# EasyEDA Pro project STM32F103-260914.epro, schematic Schematic1
Board Name: Board1; Create Date: 2026-09-14; Page Name: P1; Project Name: STMF103-260914; Schematic Name: Schematic1; Update Date: 2026-09-17; Company: 嘉立创EDA; Page Size: A4; Version: V1.0
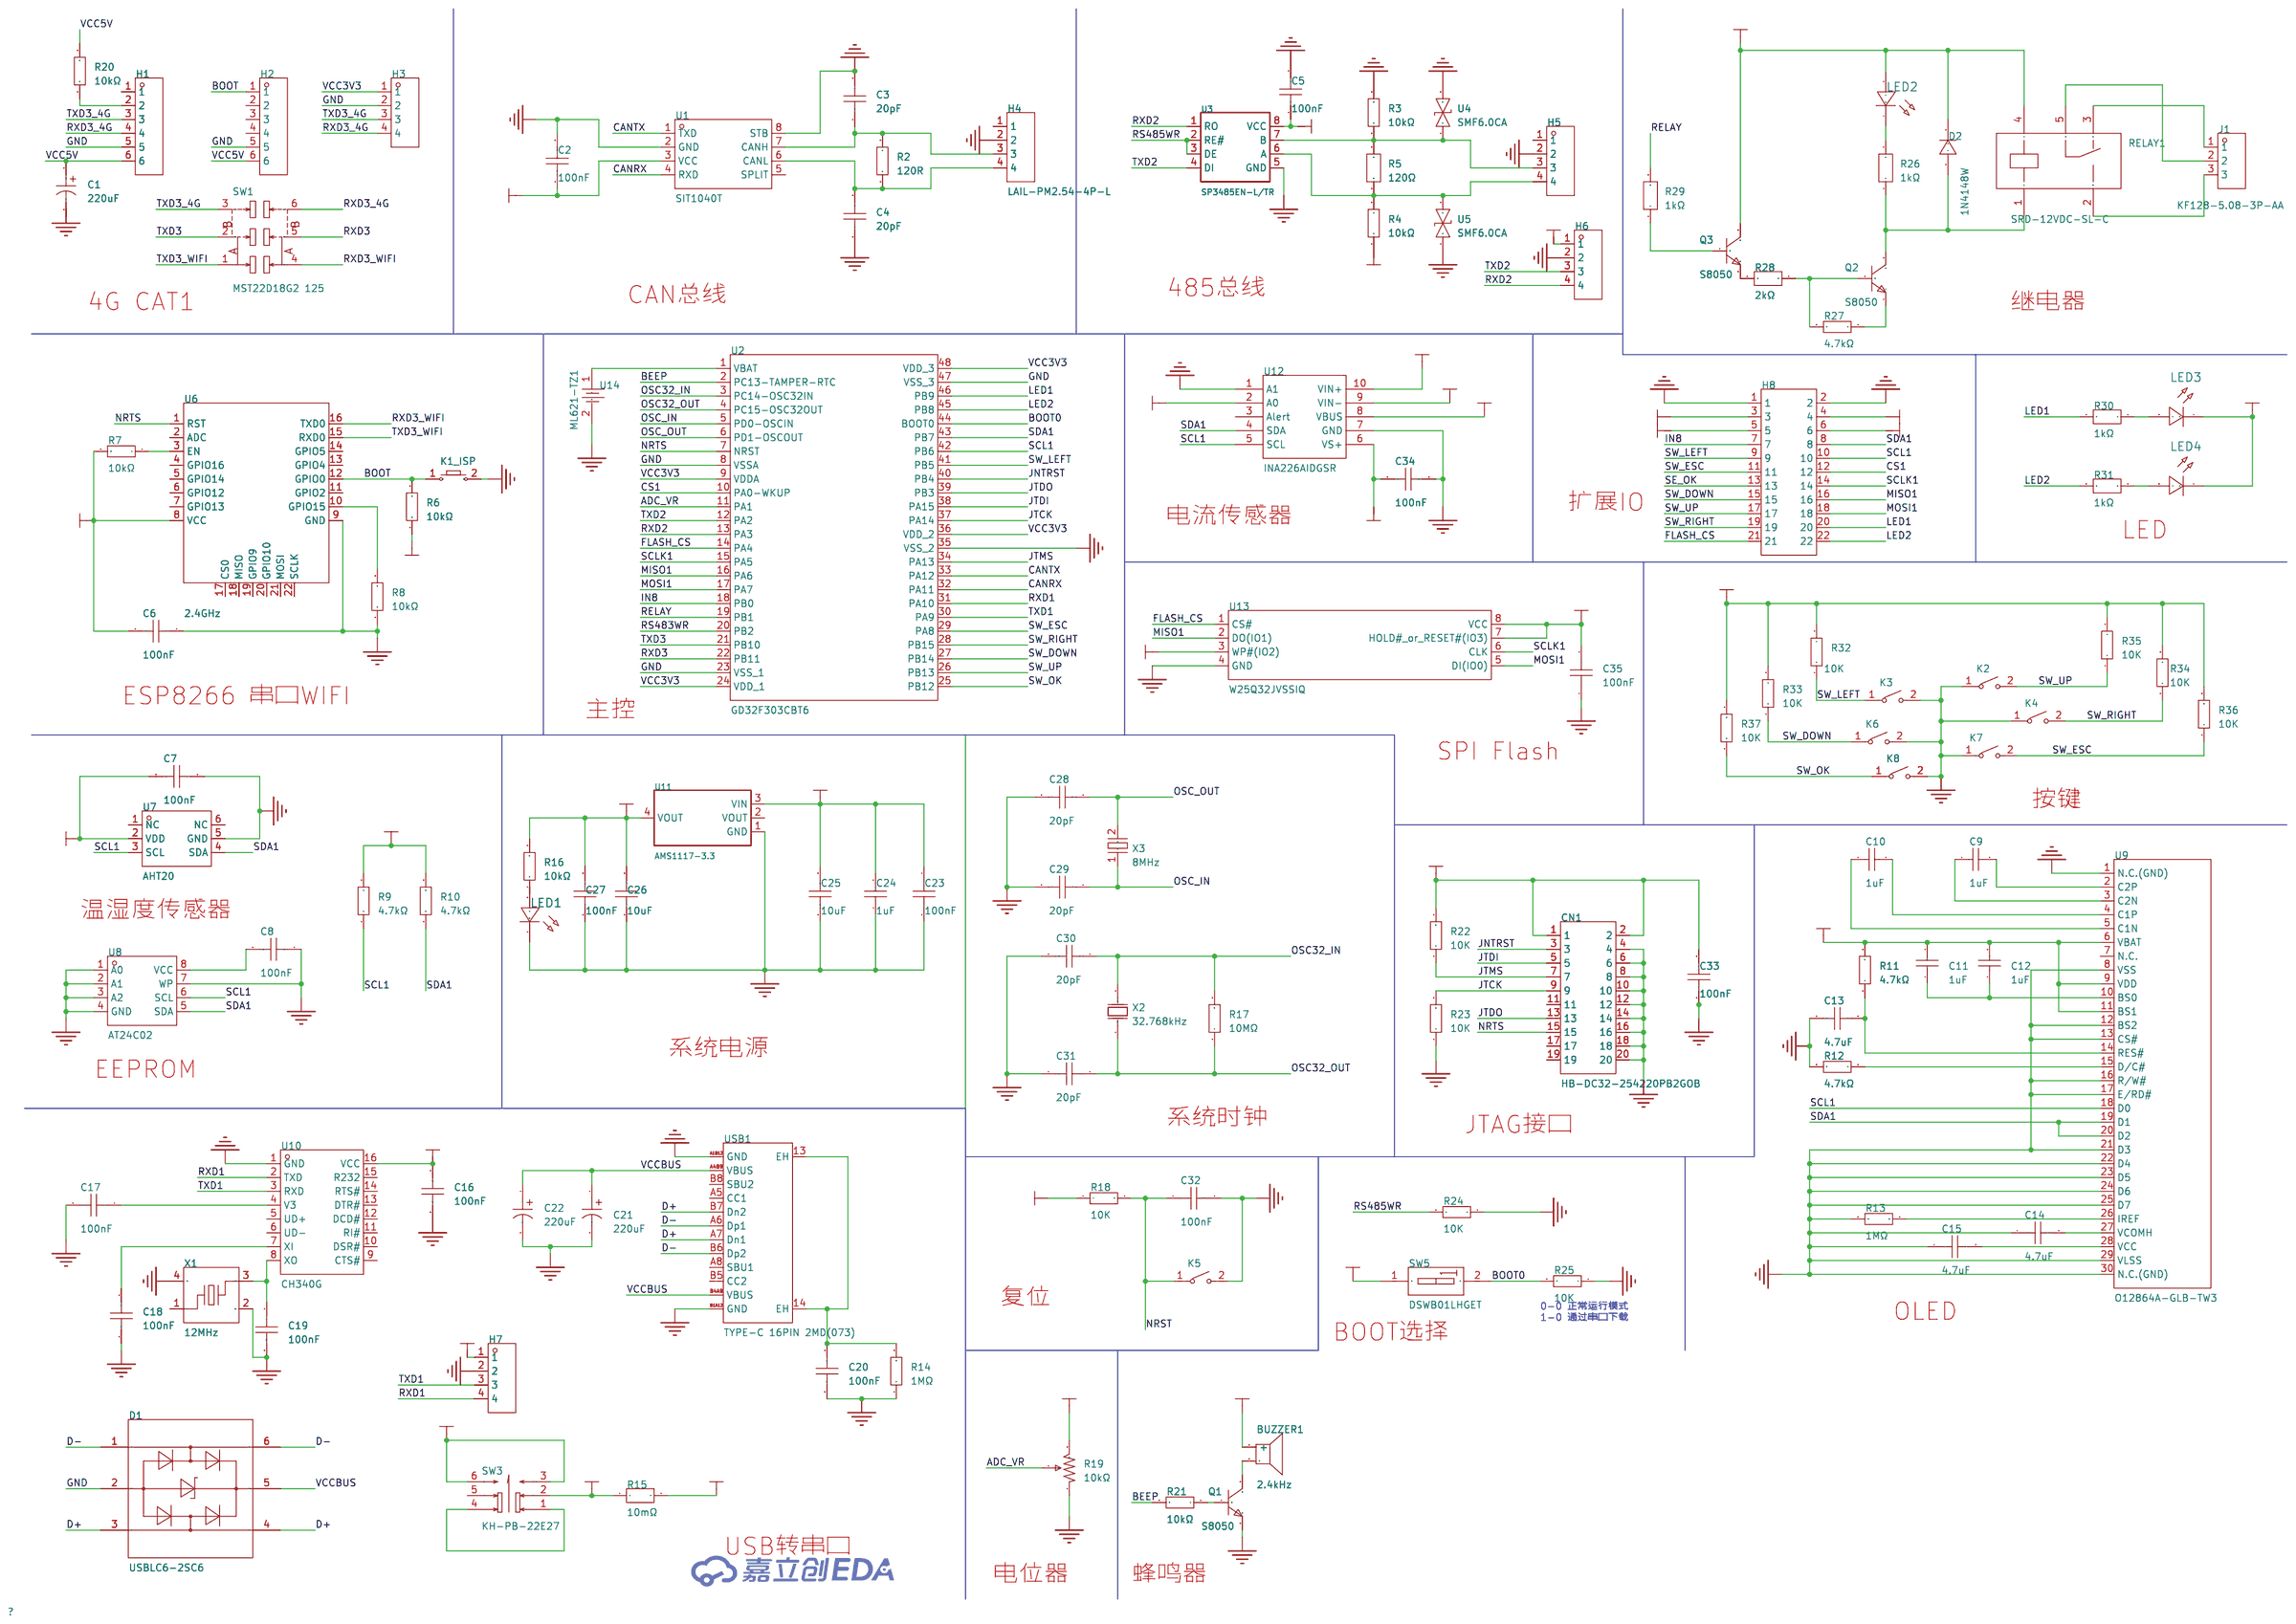
[diagram p0: schematic sheet]

## Parts
BUZZER1  2.4kHz  [BUZ-TH_BD12.0-P7.60-D0.6-FD]
C1  220uF  [CAP-SMD_BD6.3-L6.6-W6.6-FD]
C2  100nF  [C0805]
C3  20pF  [C0805]
C4  20pF  [C0805]
C5  100nF  [C0603]
C6  100nF  [C0603]
C7  100nF  [C0603]
C8  100nF  [C0603]
C9  1uF  [C0603]
C10  1uF  [C0603]
C11  1uF  [C0603]
C12  1uF  [C0603]
C13  4.7uF  [C0603]
C14  4.7uF  [C0603]
C15  4.7uF  [C0603]
C16  100nF  [C0603]
C17  100nF  [C0603]
C18  100nF  [C0603]
C19  100nF  [C0603]
C20  100nF  [C0603]
C21  220uF  [CAP-SMD_BD6.3-L6.6-W6.6-FD]
C22  220uF  [CAP-SMD_BD6.3-L6.6-W6.6-FD]
C23  100nF  [C0603]
C24  1uF  [C0603]
C25  10uF  [C0603]
C26  10uF  [C0603]
C27  100nF  [C0603]
C28  20pF  [C0805]
C29  20pF  [C0805]
C30  20pF  [C0805]
C31  20pF  [C0805]
C32  100nF  [C0603]
C33  100nF  [C0603]
C34  100nF  [C0603]
C35  100nF  [C0603]
CN1  HB-DC32-254220PB2GOB  [CONN-TH-20P_HB-DC32-254220PB2GOB]
D1  USBLC6-2SC6  [SOT-23-6_L2.9-W1.6-P0.95-LS2.8-BL]
D2  1N4148W  [SOD-123F_L2.7-W1.6-LS3.8-RD]
H1  -  [HDR-TH_6P-P2.54-V-F]
H2  -  [HDR-TH_6P-P2.54-V-F]
H3  -  [HDR-TH_4P-P2.54-V-F]
H4  LAIL-PM2.54-4P-L  [HDR-TH_4P-P2.54-V-F]
H5  PM254V-11-04-H85  [HDR-TH_4P-P2.54-V-F]
H6  -  [HDR-TH_4P-P2.54-V-F]
H7  -  [HDR-TH_4P-P2.54-V-F]
H8  PZ254V-12-22P  [HDR-TH_22P-P2.54-V-M-R2-C11-S2.54]
J1  KF128-5.08-3P-AA  [CONN-TH_3P-P5.08_KF128-5.08-3P]
K1_ISP  KH-6X6X5H-STM  [SW-SMD_4P-L6.0-W6.0-P4.50-LS9.0_H5.0]
K2  TS-1088R-02026  [SW-SMD_L3.9-W3.0-P4.45]
K3  TS-1088R-02026  [SW-SMD_L3.9-W3.0-P4.45]
K4  TS-1088R-02026  [SW-SMD_L3.9-W3.0-P4.45]
K5  TS-1088R-02026  [SW-SMD_L3.9-W3.0-P4.45]
K6  TS-1088R-02026  [SW-SMD_L3.9-W3.0-P4.45]
K7  TS-1088R-02026  [SW-SMD_L3.9-W3.0-P4.45]
K8  TS-1088R-02026  [SW-SMD_L3.9-W3.0-P4.45]
LED1  -  [LED_0603]
LED2  -  [LED_0603]
LED3  -  [LED_0603]
LED4  -  [LED_0603]
Q1  S8050  [SOT-23-3_L2.9-W1.3-P1.90-LS2.3-BR]
Q2  S8050  [SOT-23-3_L2.9-W1.3-P1.90-LS2.3-BR]
Q3  S8050  [SOT-23-3_L2.9-W1.3-P1.90-LS2.3-BR]
R2  120R  [R0805]
R3  10kΩ  [R0603]
R4  10kΩ  [R0603]
R5  120Ω  [R1206]
R6  10kΩ  [R0603]
R7  10kΩ  [R0603]
R8  10kΩ  [R0603]
R9  4.7kΩ  [R0402]
R10  4.7kΩ  [R0402]
R11  4.7kΩ  [R0402]
R12  4.7kΩ  [R0402]
R13  1MΩ  [R0603]
R14  1MΩ  [R0603]
R15  10mΩ  [R2512]
R16  10kΩ  [R0603]
R17  10MΩ  [R0603]
R18  10K  [R0805]
R19  10kΩ  [RES-ADJ-TH_3362P]
R20  10kΩ  [R0603]
R21  10kΩ  [R0603]
R22  10K  [R0805]
R23  10K  [R0805]
R24  10K  [R0805]
R25  10K  [R0805]
R26  1kΩ  [R0603]
R27  4.7kΩ  [R0402]
R28  2kΩ  [R0603]
R29  1kΩ  [R0603]
R30  1kΩ  [R0603]
R31  1kΩ  [R0603]
R32  10K  [R0805]
R33  10K  [R0805]
R34  10K  [R0805]
R35  10K  [R0805]
R36  10K  [R0805]
R37  10K  [R0805]
RELAY1  SRD-12VDC-SL-C  [RELAY-TH_SRD-XXVDC-XL-C]
SW1  MST22D18G2 125  [SW-SMD_MST22D18G2]
SW3  KH-PB-22E27  [SW-TH_6P-L7.0-W7.0-P2.00-LS5.0]
SW5  DSWB01LHGET  [SW-TH_DSWB01LHGET]
U1  SIT1040T  [SO-8_L4.9-W3.9-P1.27-LS5.9-BL]
U2  GD32F303CBT6  [LQFP-48_L7.0-W7.0-P0.50-LS9.0-BL]
U3  SP3485EN-L/TR  [SO-8_L4.9-W3.9-P1.27-LS6.0-BL]
U4  SMF6.0CA  [SOD-123FL_L2.8-W1.8-LS3.7-BI]
U5  SMF6.0CA  [SOD-123FL_L2.8-W1.8-LS3.7-BI]
U6  2.4GHz  [WIFIM-SMD_ESP-12F-ESP8266MOD]
U7  AHT20  [SENSOR-SMD_L3.0-W3.0-P1.00-BR]
U8  AT24C02  [SOP-8_L5.0-W4.0-P1.27-LS6.0-BL]
U9  O12864A-GLB-TW3  [LCD-SMD_O12864A-GLB-TW3]
U10  CH340G  [SOIC-16_L9.9-W3.9-P1.27-LS6.0-BL]
U11  AMS1117-3.3  [SOT-223-3_L6.5-W3.4-P2.30-LS7.0-BR]
U12  INA226AIDGSR  [MSOP-10_L3.0-W3.0-P0.50-LS5.0-BL]
U13  W25Q32JVSSIQ  [SOIC-8_L5.3-W5.3-P1.27-LS8.0-BL]
U14  ML621-TZ1  [BAT-SMD_ML621-TZ1]
USB1  TYPE-C 16PIN 2MD(073)  [USB-C-SMD_TYPE-C-16PIN-2MD-073]
X1  12MHz  [CRYSTAL-SMD_4P-L3.2-W2.5-BL]
X2  32.768kHz  [OSC-SMD_L3.2-W1.5]
X3  8MHz  [CRYSTAL-SMD_L5.0-W3.2]

## Library data of the parts
BUZZER1 = TMB12A05_C96093: 驱动方式:有源(内含驱动线路);构造类型:电磁式;额定电压:5V;频率:2.4kHz;声压(SPL):85dB;; LCSC Part Name: 有源(内含驱动线路) 电磁式 2.4kHz; Supplier Part: C96093; Manufacturer: 华能; Manufacturer Part: TMB12A05; Supplier Footprint: 插件,D=12mm; JLCPCB Part Class: 扩展库; Datasheet: https://item.szlcsc.com/datasheet/TMB12A05/97297.html; Supplier: LCSC; Driver Circuitry: 有源(内含驱动线路); Technology: 电磁式; Voltage Rating: 5V; Voltage - Supply: 4V~8V; Current Consumption: 30mA; Sound Pressure Level(SPL): 85dB; Diameter(φD): 12mm; Height: 9.8mm; Operating Temperature: -40℃~+85℃; Mounting Type: 插件
C1 = JVJ35V220M6x8: 容值:220uF;精度:±20%;额定电压:35V;纹波电流:190mA@120Hz;; LCSC Part Name: 220uF ±20% 35V; Supplier Part: C46550411; Manufacturer: JIERR(捷而瑞); Supplier Footprint: SMD,D6.3xL7.7mm; JLCPCB Part Class: 扩展库; Datasheet: https://item.szlcsc.com/datasheet/JVJ35V220M6x8/48680105.html; Supplier: LCSC; Tolerance: ±20%; Voltage Rating: 35V; Ripple Current: 190mA@120Hz; Diameter: 6.3mm; Height - Seated (Max): 7.7mm; Lifetime: 2000hrs@105℃; Operating Temperature: -55℃~+105℃
C2-C4 C28-C31 = CAP_0805: Supplier Footprint: 0805
C5-C8 C16-C20 C23 C27 C32-C35 = CC0603KRX7R0BB104: 容值:100nF;精度:±10%;额定电压:100V;温度系数:X7R;; LCSC Part Name: 100nF ±10% 100V; Supplier Part: C113803; Manufacturer: YAGEO(国巨); Supplier Footprint: 0603; Datasheet: https://item.szlcsc.com/datasheet/CC0603KRX7R0BB104/115039.html; Supplier: LCSC; Tolerance: ±10%; Voltage Rating: 100V; Temperature Coefficient: X7R
C9-C12 C24 = CC0603KRX5R8BB105: 容值:1uF;精度:±10%;额定电压:25V;温度系数:X5R;; LCSC Part Name: 1uF ±10% 25V; Supplier Part: C14664; Manufacturer: YAGEO(国巨); Supplier Footprint: 0603; JLCPCB Part Class: 扩展库; Datasheet: https://item.szlcsc.com/datasheet/CC0603KRX5R8BB105/15332.html; Supplier: LCSC; Tolerance: ±10%; Voltage Rating: 25V; Temperature Coefficient: X5R
C13-C15 = CL10A475KO8NNNC: 容值:4.7uF;精度:±10%;额定电压:16V;温度系数:X5R;; LCSC Part Name: 4.7uF ±10% 16V; Supplier Part: C19666; Manufacturer: SAMSUNG(三星); Supplier Footprint: 0603; JLCPCB Part Class: 基础库; Datasheet: https://item.szlcsc.com/datasheet/CL10A475KO8NNNC/20375.html; Supplier: LCSC; Tolerance: ±10%; Voltage Rating: 16V; Temperature Coefficient: X5R
C21 C22 = 189RV0019: 容值:220uF;精度:±20%;额定电压:35V;纹波电流:600mA@100kHz;等效串联电阻(ESR):160mΩ@100kHz;; LCSC Part Name: 220uF ±20% 35V; Supplier Part: C7471881; Manufacturer: KNSCHA(科尼盛); Supplier Footprint: SMD,D6.3xL7.7mm; JLCPCB Part Class: 扩展库; Datasheet: https://item.szlcsc.com/datasheet/189RV0019/8528081.html; Supplier: LCSC; Tolerance: ±20%; Voltage Rating: 35V; Ripple Current: 600mA@100kHz; Equivalent Series Resistance(ESR): 160mΩ@100kHz; Diameter: 6.3mm; Height - Seated (Max): 7.7mm; Lifetime: 2000hrs@105℃; Operating Temperature: -55℃~+105℃
C25 C26 = CL10A106MA8NRNC: 容值:10uF;精度:±20%;额定电压:25V;温度系数:X5R;; LCSC Part Name: 10uF ±20% 25V; Supplier Part: C96446; Manufacturer: SAMSUNG(三星); Supplier Footprint: 0603; Datasheet: https://item.szlcsc.com/datasheet/CL10A106MA8NRNC/97651.html; Supplier: LCSC; Tolerance: ±20%; Voltage Rating: 25V; Temperature Coefficient: X5R
CN1 = HB-DC32-254220PB2GOB: 连接器类型:简牛座;间距:2.54mm;结构:2x10P;额定电流:3A;安装方式:直插;行距:2.54mm;排数:2;每排PIN数:10;触头材质:黄铜;触头镀层:金;工作温度:-40℃~+105℃;; LCSC Part Name: 2.54mm 2x10P 排数:2 每排P数:10; Supplier Part: C46598206; Manufacturer: HANBO(汉博); Supplier Footprint: 插件,P=2.54mm; Datasheet: https://item.szlcsc.com/datasheet/HB-DC32-254220PB2GOB/48740869.html; Supplier: LCSC; Connector Type: 简牛座; Pitch: 2.54mm; Number of Positions or Pins: 2x10P; Current Rating: 3A; Holder Type: 直插; Row Spacing: 2.54mm; Number of Rows: 2; Number of PINs Per Row: 10; Contact Material: 黄铜; Contact Plating: 金; Operating Temperature: -40℃~+105℃; Color: 黑色
D1 = USBLC6-2SC6_C7519: 极性:单向;反向截止电压(Vrwm):5.25V;钳位电压:17V;峰值脉冲电流(Ipp):5A;击穿电压(VBR):6V;; LCSC Part Name: 单向ESD 5.25V截止 峰值脉冲电流：5A; Supplier Part: C7519; Manufacturer: ST(意法半导体); Supplier Footprint: SOT-23-6L; JLCPCB Part Class: 扩展库; Datasheet: https://item.szlcsc.com/datasheet/USBLC6-2SC6/7996.html; Supplier: LCSC; Polarity: 单向; Reverse Stand-Off Voltage (Vrwm): 5.25V; Clamping Voltage: 17V; Peak Pulse Current (Ipp): 5A; Voltage - Breakdown: 6V; Reverse Leakage Current (Ir): 150nA; Number of Channels: 双路; Operating Temperature: -40℃~+125℃; level of protection: IEC 61000-4-2; Type: ESD; Junction Capacitance: 3.5pF
D2 = 1N4148W_C81598: 二极管配置:独立式;正向压降(Vf):1V@50mA;直流反向耐压(Vr):75V;整流电流:150mA;反向恢复时间(Trr):4ns;; Supplier Part: C81598; Manufacturer: ST(先科); Supplier Footprint: SOD-123; Datasheet: https://item.szlcsc.com/datasheet/1N4148W/82750.html; Supplier: LCSC; Diode Configuration: 独立式; Voltage - Forward(Vf@If): 1V@50mA; Voltage - DC Reverse(Vr): 75V; Current - Rectified: 150mA; Pd - Power Dissipation: 400mW; Reverse Leakage Current (Ir): 1uA@75V; Reverse Recovery Time (trr): 4ns; Non-Repetitive Peak Forward Surge Current: 1A
H1 H2 = HDR-F_2.54_1x6P: Supplier Part: C40877; Supplier Footprint: 插件
H3 H6 H7 = HDR-F_2.54_1x4P: Supplier Part: C2718488; Supplier Footprint: 插件
H4 = LAIL-PM2.54-4P-L: 插孔结构:1x4P;间距:2.54mm;圆孔/方孔:方孔;安装方式:直插;排数:单排;总孔位数:4P;额定电流:3A;额定电压:250V;插孔方向:顶部;塑高:8.5mm;触头材质:黄铜;触头镀层:金;工作温度:-25℃~+80℃;; LCSC Part Name: 1x4P 间距:2.54mm 直插; Supplier Part: C54973823; Manufacturer: LAILAN(莱联); Supplier Footprint: 插件,P=2.54mm; JLCPCB Part Class: Extended Part; Datasheet: https://item.szlcsc.com/datasheet/LAIL-PM2.54-4P-L/58554901.html; Supplier: LCSC; Holes Structure: 1x4P; Pitch: 2.54mm; Circular Hole / Square Hole: 方孔; Mounting Type: 直插; Number of Rows: 单排; Number of Positions: 4P; Current Rating: 3A; Voltage Rating (Max): 250V; Holes Direction: 顶部; Insulation Height: 8.5mm; Contact Material: 黄铜; Contact Plating: 金; Operating Temperature: -25℃~+80℃; PIN Length: 3mm
H5 = PM254V-11-04-H85: 插孔结构:1x4P;间距:2.54mm;行距:-;圆孔/方孔:方孔;安装方式:直插;排数:单排;总孔位数:4P;额定电流:3A;额定电压:250V;插孔方向:顶部;塑高:8.5mm;触头材质:黄铜;触头镀层:金;工作温度:-40℃~+105℃;; LCSC Part Name: 1x4P 间距:2.54mm 直插; Supplier Part: C541851; Manufacturer: XFCN(兴飞); Supplier Footprint: 插件,P=2.54mm; JLCPCB Part Class: Extended Part; Datasheet: https://item.szlcsc.com/datasheet/PM254V-11-04-H85/562472.html; Supplier: LCSC; Holes Structure: 1x4P; Pitch: 2.54mm; Circular Hole / Square Hole: 方孔; Mounting Type: 直插; Number of Rows: 单排; Number of Positions: 4P; Current Rating: 3A; Voltage Rating (Max): 250V; Holes Direction: 顶部; Insulation Height: 8.5mm; Contact Material: 黄铜; Contact Plating: 金; Operating Temperature: -40℃~+105℃; PIN Length: 3.2mm
H8 = PZ254V-12-22P: 插针结构:2x11P;间距:2.54mm;行距:2.54mm;圆针/方针:方针;安装方式:直插;排数:双排;总PIN位数:22P;额定电流:-;额定电压:-;配合针长度:6mm;塑高:2.5mm;端接针长度:3mm;触头材质:黄铜;触头镀层:-;工作温度:-40℃~+105℃;颜色:黑色;; LCSC Part Name: 2x11P 间距:2.54mm 方针 直插; Supplier Part: C492428; Manufacturer: XFCN(兴飞); Supplier Footprint: 插件,P=2.54mm; JLCPCB Part Class: 扩展库; Datasheet: https://item.szlcsc.com/datasheet/PZ254V-12-22P/502984.html; Supplier: LCSC; Pin Structure: 2x11P; Pitch: 2.54mm; Row Spacing: 2.54mm; Circluar Pins/Square Pins: 方针; Mounting Type: 直插; Number of Rows: 双排; Number of Pins: 22P; Length of Mating Pin: 6mm; Insulation Height: 2.5mm; Length of End Connection Pin: 3mm; Contact Material: 黄铜; Operating Temperature: -40℃~+105℃; Color: 黑色
J1 = KF128-5.08-3P-AA: 结构:1x3P;间距:5.08mm;颜色:绿色;安装类型:直插;排数:1;每排PIN数:3;额定电流:24A;额定电压:250V;线规 - AWG:12~22;线规 - 平方毫米:2.5;工作温度:-40℃~+105℃;; LCSC Part Name: 1x3P 5.08mm 直插 排数:1 每排P数:3; Supplier Part: C474953; Manufacturer: KEFA(科发); Supplier Footprint: 插件,P=5.08mm; JLCPCB Part Class: 扩展库; Datasheet: https://item.szlcsc.com/datasheet/KF128-5.08-3P-AA/481571.html; Supplier: LCSC; Number of Positions or Pins: 1x3P; Pitch: 5.08mm; Color: 绿色; Mounting Type: 直插; Number of Pins: 3P; Number of Rows: 1; Number of PINs Per Row: 3; Screw Specification: M2.5; Current Rating: 24A; Voltage Rating (Max): 250V; Wire Gauge - AWG: 12~22; Wire Gauge - mm2: 2.5; Operating Temperature: -40℃~+105℃; Height Above Board: 14.1mm
K1_ISP = KH-6X6X5H-STM: 电路结构:单刀单掷;按钮形状:圆形按钮;安装方式:立贴;开关长度:6mm;开关宽度:6mm;开关高度:5mm;带支架:不带支架;触点电流:50mA;额定电压:12V;工作寿命:8万次;; LCSC Part Name: 6*6*5mm 立贴 轻触开关; Supplier Part: C2837531; Manufacturer: kinghelm(金航标); Supplier Footprint: SMD-4P,6x6mm; JLCPCB Part Class: Extended Part; Datasheet: https://item.szlcsc.com/datasheet/KH-6X6X5H-STM/3009601.html; Supplier: LCSC; Circuit: 单刀单掷; Actuator Style: 圆形按钮; Mounting Type: 立贴; Length: 6mm; Width: 6mm; Switch Height: 5mm; with Bracket: 不带支架; Contact Current: 50mA; Voltage Rating: 12V; Actuator/Cap Color: 黑色; Termination Style: 鸥翼型; Life: 8万次
K2-K8 = TS-1088R-02026: 电路结构:单刀单掷;按钮形状:圆形按钮;作用力:2.6N;安装方式:立贴;开关长度:3.9mm;开关宽度:2.93mm;开关高度:2mm;带支架:不带支架;触点电流:50mA;额定电压:12V;带灯:-;工作寿命:10万次;; LCSC Part Name: 3.9*2.93*2mm 立贴 轻触开关; Supplier Part: C455280; Manufacturer: XUNPU(讯普); Supplier Footprint: SMD,4x3mm; JLCPCB Part Class: 扩展库; Datasheet: https://item.szlcsc.com/datasheet/TS-1088R-02026/457635.html; Supplier: LCSC; Circuit: 单刀单掷; Actuator Style: 圆形按钮; Operating Force: 2.6N; Mounting Type: 立贴; Length: 3.9mm; Width: 2.93mm; Switch Height: 2mm; with Bracket: 不带支架; Contact Current: 50mA; Voltage Rating: 12V; Actuator/Cap Color: 黑色; Termination Style: SMD接片; Life: 10万次
LED1-LED4 = LED_0603-R: Supplier Footprint: 0603
Q1-Q3 = S8050_C20069125: 晶体管类型:NPN;集电极电流(Ic):500mA;集射极击穿电压(Vceo):25V;耗散功率(Pd):300mW;直流电流增益(hFE):120;; LCSC Part Name: hFE:200-350，丝印:J3Y NPN 500mA 25V; Supplier Part: C20069125; Manufacturer: R+O(宏嘉诚); Supplier Footprint: SOT-23; JLCPCB Part Class: 扩展库; Datasheet: https://item.szlcsc.com/datasheet/S8050/21397163.html; Supplier: LCSC; type: NPN; Current - Collector(Ic): 500mA; Collector - Emitter Voltage VCEO: 25V; Pd - Power Dissipation: 300mW; DC Current Gain: 120; Transition frequency(fT): 100MHz; Current - Collector Cutoff: 100nA; Vce Saturation(VCE(sat)): 600mV; Operating Temperature: -55℃~+150℃; Emitter-Base Voltage(Vebo): 5V; Number: 1个NPN; Configuration: 独立式
R2 R18 R22-R25 R32-R37 = Res_0805: Supplier Footprint: 0805
R3 R4 R6-R8 R16 R20 R21 = 0603WAF1002T5E: 电阻类型:厚膜电阻;阻值:10kΩ;精度:±1%;功率:100mW;工作电压:75V;温度系数:±100ppm/℃;; LCSC Part Name: 厚膜电阻 10kΩ ±1% 100mW; Supplier Part: C25804; Manufacturer: UNI-ROYAL(厚声); Supplier Footprint: 0603; JLCPCB Part Class: 基础库; Datasheet: https://item.szlcsc.com/datasheet/0603WAF1002T5E/26547.html; Supplier: LCSC; Type: 厚膜电阻; Tolerance: ±1%; Power(Watts): 100mW; Voltage-Supply(Max): 75V; Temperature Coefficient: ±100ppm/℃; Operating Temperature: -55℃~+155℃
R5 = FRC1206F1200TS: 电阻类型:厚膜电阻;阻值:120Ω;精度:±1%;功率:250mW;工作电压:200V;温度系数:±100ppm/℃;; LCSC Part Name: 120Ω ±1% 250mW 厚膜电阻; Supplier Part: C2933584; Manufacturer: FOJAN(富捷); Supplier Footprint: 1206; JLCPCB Part Class: 扩展库; Supplier: LCSC; Type: 厚膜电阻; Tolerance: ±1%; Power(Watts): 250mW; Voltage-Supply(Max): 200V; Temperature Coefficient: ±100ppm/℃; Operating Temperature: -55℃~+155℃
R9-R12 R27 = RC0402FR-074K7L: 电阻类型:厚膜电阻;阻值:4.7kΩ;精度:±1%;功率:62.5mW;工作电压:50V;温度系数:±100ppm/℃;; LCSC Part Name: 厚膜电阻 4.7kΩ ±1% 62.5mW; Supplier Part: C105871; Manufacturer: YAGEO(国巨); Supplier Footprint: 0402; JLCPCB Part Class: 扩展库; Datasheet: https://item.szlcsc.com/datasheet/RC0402FR-074K7L/107086.html; Supplier: LCSC; Type: 厚膜电阻; Tolerance: ±1%; Power(Watts): 62.5mW; Voltage-Supply(Max): 50V; Temperature Coefficient: ±100ppm/℃; Operating Temperature: -55℃~+155℃
R13 R14 R17 = 0603WAF1004T5E: 电阻类型:厚膜电阻;阻值:1MΩ;精度:±1%;功率:100mW;工作电压:75V;温度系数:±100ppm/℃;; LCSC Part Name: 1MΩ ±1% 100mW 厚膜电阻; Supplier Part: C22935; Manufacturer: UNI-ROYAL(厚声); Supplier Footprint: 0603; JLCPCB Part Class: 基础库; Datasheet: https://item.szlcsc.com/datasheet/0603WAF1004T5E/23662.html; Supplier: LCSC; Type: 厚膜电阻; Tolerance: ±1%; Power(Watts): 100mW; Voltage-Supply(Max): 75V; Temperature Coefficient: ±100ppm/℃; Operating Temperature: -55℃~+155℃
R15 = RE2512F3R010: 电阻类型:采样电阻；合金电阻;阻值:10mΩ;精度:±1%;功率:3W;温度系数:±50ppm/℃;安装方式:贴片;; LCSC Part Name: 10mΩ 3W 2512 ±1%; Supplier Part: C46961753; Manufacturer: JIERR(捷而瑞); Supplier Footprint: 2512; JLCPCB Part Class: 扩展库; Datasheet: https://item.szlcsc.com/datasheet/RE2512F3R010/49133292.html; Supplier: LCSC; Type: 采样电阻；合金电阻; Tolerance: ±1%; Power(Watts): 3W; Temperature Coefficient: ±50ppm/℃; Mounting Type: 贴片
R19 = 3362P-1-103_C48997914: 阻值:10kΩ;精度:±10%;功率:500mW;温度系数:±250ppm/℃;; LCSC Part Name: 10kΩ 500mW ±10%; Supplier Part: C48997914; Manufacturer: JIERR(捷而瑞); Manufacturer Part: 3362P-1-103; Supplier Footprint: 插件-3P,7x6.8mm; Datasheet: https://item.szlcsc.com/datasheet/3362P-1-103/51342050.html; Supplier: LCSC; Tolerance: ±10%; Power(Watts): 500mW; Temperature Coefficient: ±250ppm/℃; Number of Turns: 1
R26 R28-R31 = PTFR0603B1K00N9: 电阻类型:薄膜电阻;阻值:1kΩ;精度:±0.1%;功率:100mW;工作电压:100V;温度系数:±10ppm/℃;; LCSC Part Name: 薄膜电阻 1kΩ ±0.1% 100mW; Supplier Part: C394536; Manufacturer: RESI(开步睿思); Supplier Footprint: 0603; Datasheet: https://item.szlcsc.com/datasheet/PTFR0603B1K00N9/373961.html; Supplier: LCSC; Type: 薄膜电阻; Tolerance: ±0.1%; Power(Watts): 100mW; Voltage-Supply(Max): 100V; Temperature Coefficient: ±10ppm/℃; Operating Temperature: -55℃~+125℃
RELAY1 = SRD-12VDC-SL-C: 线圈电压:12V;触点形式:一组转换:1C(单刀双掷-转换);触点容量(电阻负载):-;最大切换电压:250V@AC;最大切换电流:15A;; LCSC Part Name: 单组转换型继电器; Supplier Part: C30431; Manufacturer: 松乐; Supplier Footprint: 插件,19.2x15.6mm; JLCPCB Part Class: 扩展库; Datasheet: https://item.szlcsc.com/datasheet/SRD-12VDC-SL-C/31188.html; Supplier: LCSC; Coil Voltage: 12V; Contact Form: 一组转换:1C(单刀双掷-转换); Number of Pins: 5; Switching Voltage(Max): 250V@AC; Coil Rated Power: 360mW; Switching Current(Max): 15A; Coil Type: 无极性-单线圈; Coil Resistance: 400Ω; Contact Resistance: 100mΩ; Operate Time: 10ms; Release Time: 10ms; Length: 19.2mm; Width: 15.6mm; Height: 15.8mm
SW1 = MST22D18G2 125: 电路结构:双刀双掷;安装方式:立贴;开关颜色:黑色;额定电流:100mA;额定电压:12V;工作寿命:1万次;; LCSC Part Name: MST-22D18G2脚距6.9; Supplier Part: C2906280; Manufacturer: SHOU HAN(首韩); Supplier Footprint: SMD; JLCPCB Part Class: 扩展库; Datasheet: https://item.szlcsc.com/datasheet/MST22D18G2%2520125/3178990.html; Supplier: LCSC; Circuit: 双刀双掷; Termination Style: 鸥翼型; Mounting Type: 立贴; Actuator Color: 黑色; Current Rating: 100mA; Voltage Rating: 12V; Life: 1万次; Operating Temperature: -25℃~+70℃
SW3 = KH-PB-22E27: 7*7*15.9H六脚自锁 PB-22E27; Supplier Part: C49424352; Manufacturer: kinghelm(金航标); Supplier Footprint: 插件; JLCPCB Part Class: 扩展库; Datasheet: https://item.szlcsc.com/datasheet/KH-PB-22E27/51954704.html; Supplier: LCSC
SW5 = DSWB01LHGET: 类型:平拨,凸起式;电路结构:单刀单掷;开关位数:1位;工作寿命:-;颜色:红色;; LCSC Part Name: 红色宽体1位顶拨插件; Supplier Part: C126888; Manufacturer: YE; Supplier Footprint: 插件,9.9x4mm; Datasheet: https://item.szlcsc.com/datasheet/DSWB01LHGET/138168.html; Supplier: LCSC; Type: 平拨,凸起式; Circuit: 单刀单掷; Number of Positions: 1位; Color: 红色
U1 = SIT1040T: 类型:CAN收发器;数据速率:1Mbps;; LCSC Part Name: 5V供电，±40V接口耐压，1Mbps高速CAN总线收发器; Supplier Part: C381512; Manufacturer: SIT(芯力特); Supplier Footprint: SO-8; JLCPCB Part Class: 扩展库; Datasheet: https://item.szlcsc.com/datasheet/SIT1040T/353922.html; Supplier: LCSC; Type: CAN收发器; Data Rate: 1Mbps; Voltage - Supply: 4.5V~5.5V; Current - Supply: 70mA; Operating Temperature: -40℃~+125℃; Number of Channels: 1; Quiescent Supply Current: 12uA; Features: 短路保护；唤醒功能；热关断保护；TXD占优超时；低功耗模式
U2 = GD32F303CBT6_C3013779: CPU内核:ARM Cortex-M4;CPU最大主频:120MHz;CPU位数:32 Bit;; LCSC Part Name: ARM Cortex-M4 32位微控制器; Supplier Part: C3013779; Manufacturer: GigaDevice(兆易创新); Supplier Footprint: LQFP-48(7x7); Datasheet: https://item.szlcsc.com/datasheet/GD32F303CBT6/3521736.html; Supplier: LCSC; CPU Core: ARM Cortex-M4; CPU Maximum Speed: 120MHz; Core Size: 32 Bit; Program Storage Size: 128KB; Program Memory Type: FLASH; RAM Size: 32KB; Number of I/O: 48; ADC (Bit): 12bit; DAC (Bit): 12bit; Oscillator Type: 内置+外置; Voltage - Supply: 2.6V~3.6V
U3 = SP3485EN-L/TR_C41365340: 类型:收发器;数据速率:14Mbps;; LCSC Part Name: RS-485/RS422收发器; Supplier Part: C41365340; Manufacturer: ElecSuper(静芯); Supplier Footprint: SOP-8; Datasheet: https://item.szlcsc.com/datasheet/SP3485EN-L%252FTR/43113804.html; Supplier: LCSC; Type: 收发器; Number of Drivers: 1; Number of Receivers: 1; Voltage - Supply: 3V~5.5V; Data Rate: 14Mbps; Number of Nodes: 256; ESD Protect: ±15kV; Operating Temperature: -40℃~+125℃; Quiescent Supply Current: 240uA; Communication Mode: 半双工; Features: Tx/Rx启用；使能关断；过流保护；低功耗模式
U4 U5 = SMF6.0CA_C2990473: 极性:双向;反向截止电压(Vrwm):6V;钳位电压:10.3V;峰值脉冲电流(Ipp):19.4A;峰值脉冲功率(Ppp):200W;击穿电压(VBR):6.67V;; LCSC Part Name: 双向TVS 6V截止 峰值浪涌电流：19.4A; Supplier Part: C2990473; Manufacturer: Liown(里阳半导体); Supplier Footprint: SOD-123FL; JLCPCB Part Class: 扩展库; Datasheet: https://item.szlcsc.com/datasheet/SMF6.0CA/3449907.html; Supplier: LCSC; Polarity: 双向; Reverse Stand-Off Voltage (Vrwm): 6V; Clamping Voltage: 10.3V; Peak Pulse Current (Ipp): 19.4A; Peak Pulse Power Dissipation (Ppp): 200W; Voltage - Breakdown: 6.67V; Reverse Leakage Current (Ir): 400uA; Number of Channels: 单路; Operating Temperature: -55℃~+150℃; level of protection: IEC 61000-4-2; Type: TVS
U6 = ESP-12F(ESP8266MOD): 核心芯片:ESP8266芯片;频率:2.4GHz;天线形式:板载PCB天线;发射功率:16dBm;接收灵敏度:-90dBm;; LCSC Part Name: 屏蔽罩上的丝印是：ESP8266MOD，ESP8266EX串口WIFI 完整的802.11b/g/nWi-FiSoC模块; Supplier Part: C82891; Manufacturer: Ai-Thinker(安信可); Supplier Footprint: SMD,24x16mm; JLCPCB Part Class: 扩展库; Datasheet: https://item.szlcsc.com/datasheet/ESP-12F(ESP8266MOD)/84052.html; Supplier: LCSC; Utilized IC / Part: ESP8266芯片; Interface Type: I2C；UART；SPI; Antenna Type: 板载PCB天线; Output Power: 16dBm; Voltage - Supply: 3.3V; Receive  Current: 120mA; Send  Current: 170mA; Sensitivity: -90dBm; Operating Temperature: -40℃~+85℃; Features: 在线OTA
U7 = AHT20: 温度范围:-40℃~+120℃;湿度范围:0%RH~100%RH;接口类型:I2C;湿度精度:±2%RH;; LCSC Part Name: 温湿度传感器，完全标定，数字输出，IC接口; Supplier Part: C2757850; Manufacturer: 广州奥松; Supplier Footprint: SMD; Datasheet: https://item.szlcsc.com/datasheet/AHT20/2874650.html; Supplier: LCSC; Temperature Range: -40℃~+120℃; Humidity: 0%RH~100%RH; Interface: I2C; Voltage - Supply: 2.2V~5.5V; Current - Supply: 570uA; Humidity Tolerance: ±2%RH; Temperature Tolerance: ±0.3℃; Resolution: 20bit; Features: 工厂校准
U8 = AT24C02_C688857: 接口类型:I2C;存储容量:2Kbit;时钟频率(fc):1MHz;; LCSC Part Name: 24C02 2Kbit电可擦除PROM; Supplier Part: C688857; Manufacturer: IDCHIP(英锐芯); Supplier Footprint: SOP-8; JLCPCB Part Class: 扩展库; Datasheet: https://item.szlcsc.com/datasheet/AT24C02/721923.html; Supplier: LCSC; Interface: I2C; Memory Size: 2Kbit; Clock Frequency: 1MHz; Write Cycle Time(Tw): 5ms; Data Retention - TDR (Year): 100年; Write Cycle Endurance: 100万次; Features: 硬件写保护功能；噪声抑制功能; Voltage - Supply: 1.8V~5.5V; Operating Temperature: -40℃~+85℃; Operating Current: 1mA; Standby Current: 1uA; Access Time: 900ns
U9 = O12864A-GLB-TW3: 核心芯片:SSD1306芯片;接口类型:I2C；SPI;尺寸(inch):0.96;像素分辨率:128x64;; Supplier Part: C17185316; Manufacturer: Focus Display Solutions Inc.; Datasheet: https://item.szlcsc.com/datasheet/O12864A-GLB-TW3/18314348.html; Supplier: LCSC; Controller Type: SSD1306芯片; Interface: I2C；SPI; Size: 0.96; Dot Pixels: 128x64
U10 = CH340G: 应用功能:USB转UART;USB协议版本:USB 2.0;数据速率:2Mbps;; LCSC Part Name: USB转串口芯片CH340; Supplier Part: C14267; Manufacturer: WCH(南京沁恒); Supplier Footprint: SOP-16; Datasheet: https://item.szlcsc.com/datasheet/CH340G/14927.html; Supplier: LCSC; Applications Function: USB转UART; USB Protocol: USB 2.0; Voltage - Supply: 5V；3.3V; Data Rate: 2Mbps; Operating Temperature: -40℃~+85℃; Features: 可编程波特率；内置时钟发生器；上电复位
U11 = AMS1117-3.3_C6186: 输出极性:正极;工作电压:15V;输出电压:3.3V;输出电流:1A;电源纹波抑制比(PSRR):72dB@(120Hz);输出类型:固定;; LCSC Part Name: 3.3V 1A 15V; Supplier Part: C6186; Manufacturer: Advanced Monolithic Systems; Supplier Footprint: SOT-223; JLCPCB Part Class: 基础库; Datasheet: https://item.szlcsc.com/datasheet/AMS1117-3.3/6652.html; Supplier: LCSC; Output Configuration: 正极; Voltage - Supply: 15V; Output Voltage: 3.3V; Output Current: 1A; Power Supply Rejection Ratio (PSRR): 72dB@(120Hz); Voltage Dropout: 1.1V@(800mA); standby current: 5mA; Noise: 0.003%Vout; Features: 短路保护；热关断；过流保护; Operating Temperature: -40℃~+125℃; Output Type: 固定; Number of Outputs: 1
U12 = INA226AIDGSR: 放大器数:-;共模电压:0V~36V;增益:-;带宽(-3db):-;; LCSC Part Name: 高侧/低侧测量双向电流/功率监视器，具有I²C兼容接口; Supplier Part: C49851; Manufacturer: TI(德州仪器); Supplier Footprint: VSSOP-10; JLCPCB Part Class: 扩展库; Datasheet: https://www.ti.com/cn/lit/ds/symlink/ina226.pdf; Supplier: LCSC; Vcm - Common Mode Voltage: 0V~36V; Ib - Input Bias Current: 100pA; Vos - Input Offset Voltage: 2.5uV; Operating Temperature: -40℃~+125℃; Differential Voltage: ±40V; Single Supply: 2.7V~5.5V; Quiescent Current: 330uA; Input Offset Voltage Drift(Vos TC): 0.1uV/℃; Common Mode Rejection Ratio (CMRR): 140dB; Features: 可编程阈值告警；使能/关断功能；双向检测；数字输出接口；高边检测；低边检测；功率监控
U13 = W25Q32JVSSIQ: 接口类型:SPI;存储容量:32Mbit;时钟频率(fc):133MHz;; LCSC Part Name: 支持双线、四线SPI接口的3V、32Mbit 串行SPI闪存; Supplier Part: C179173; Manufacturer: Winbond(华邦); Supplier Footprint: SOIC-8-208mil; JLCPCB Part Class: 扩展库; Datasheet: https://item.szlcsc.com/datasheet/W25Q32JVSSIQ/190567.html; Supplier: LCSC; Interface: SPI; Memory Size: 32Mbit; Clock Frequency: 133MHz; Voltage - Supply: 2.7V~3.6V; Standby Supply Current: 1uA; Program / Erase Cycles: 100000次; Page Programming Time (Tpp): 3ms; Data Retention - TDR (Year): 20年; Operating Temperature: -40℃~+85℃; Features: 硬件写保护；绝对写保护；写使能锁存；软件写保护；上电复位
U14 = ML621-TZ1: LCSC Part Name: FDK 可充电 可充电锂锰纽扣电池 3V 5.8mAh 100个/托盘; Supplier Part: C42387246; Manufacturer: FDK; JLCPCB Part Class: 扩展库; Datasheet: https://item.szlcsc.com/datasheet/ML621-TZ1/44310569.html; Supplier: LCSC
USB1 = TYPE-C 16PIN 2MD(073): 连接器类型:Type-C;协议标准:-;公母:母;安装方式:卧贴;触点数量:16P;端口数量:1;额定电流 - 电源:3A;工作温度:-25℃~+85℃;; LCSC Part Name: Type-C 母 卧贴; Supplier Part: C2765186; Manufacturer: SHOU HAN(首韩); Supplier Footprint: SMD; Datasheet: https://item.szlcsc.com/datasheet/TYPE-C%252016PIN%25202MD(073)/2901843.html; Supplier: LCSC; Connector Type: Type-C; Gender: 母; Mounting Type: 卧贴; Number of Contacts: 16P; Number of Ports: 1; Current Rating-Power: 3A; Voltage Rating: 5V; Connect-Disconnect Life: 1万次; Detection color: 黑色; Operating Temperature: -25℃~+85℃
X1 = XC32M4-12.000-F10NNFT: 晶振类型:贴片晶振;频率:12MHz;常温频差:±10ppm;负载电容:10pF;频率稳定度:±10ppm;; LCSC Part Name: 3225 4P 12MHz 10pF ±10ppm -30℃~+85℃ (±10ppm); Supplier Part: C2842186; Manufacturer: HCI(杭晶); Supplier Footprint: SMD3225-4P; JLCPCB Part Class: 扩展库; Datasheet: https://item.szlcsc.com/datasheet/XC32M4-12.000-F10NNFT/3026510.html; Supplier: LCSC; Type: 贴片晶振; Normal temperature Frequency Tolerance: ±10ppm; Load Capacitance: 10pF; Frequency Stability: ±10ppm; Equivalent Series Resistance(ESR): 100Ω; Operating Temperature: -30℃~+85℃
X2 = SF32WK32768D31T002: 晶振类型:贴片晶振;频率:32.768kHz;常温频差:±20ppm;负载电容:12.5pF;频率稳定度:-;; LCSC Part Name: 3215 32.768KHZ 12.5PF ±20PPM -40℃~+85℃; Supplier Part: C271654; Manufacturer: TKD(泰晶); Supplier Footprint: SMD3215-2P; JLCPCB Part Class: 扩展库; Datasheet: https://item.szlcsc.com/datasheet/SF32WK32768D31T002/260717.html; Supplier: LCSC; Type: 贴片晶振; Normal temperature Frequency Tolerance: ±20ppm; Load Capacitance: 12.5pF; Equivalent Series Resistance(ESR): 70kΩ; Operating Temperature: -40℃~+85℃
X3 = XC53G2-8.000-F12NJHP: 晶振类型:贴片晶振;频率:8MHz;常温频差:±10ppm;负载电容:12pF;频率稳定度:±30ppm;; LCSC Part Name: 5032 2P glass 8MHz 12pF ±10ppm -20℃~+70℃(±30ppm); Supplier Part: C2842269; Manufacturer: HCI(杭晶); Supplier Footprint: SMD5032-2P; Datasheet: https://item.szlcsc.com/datasheet/XC53G2-8.000-F12NJHP/3026543.html; Supplier: LCSC; Type: 贴片晶振; Normal temperature Frequency Tolerance: ±10ppm; Load Capacitance: 12pF; Frequency Stability: ±30ppm; Equivalent Series Resistance(ESR): 80Ω; Operating Temperature: -20℃~+70℃

## Nets
GND: C1.2 C2.2 C3.2 C4.1 C5.2 C6.1 C7.1 C8.1 C13.1 C14.1 C15.1 C16.2 C17.2 C18.2 C19.2 C20.2 C21.2 C22.2 C23.2 C24.1 C25.1 C26.1 C27.2 C28.2 C29.2 C30.2 C31.2 C32.2 C33.1 C34.2 C35.1 CN1.4 CN1.6 CN1.8 CN1.10 CN1.12 CN1.14 CN1.16 CN1.18 CN1.20 D1.2 H1.5 H2.5 H3.2 H4.2 H5.2 H6.2 H7.2 H8.1 H8.2 K1_ISP.2 K2.1 K3.2 K4.1 K5.2 K6.2 K7.1 K8.2 LED1.1(C) Q1.2(E) R3.2 R8.1 R12.2 R13.1 R14.1 R19.1 R23.1 R24.1 R25.1 U1.2(GND) U1.8(STB) U2.8(VSSA) U2.23(VSS_1) U2.35(VSS_2) U2.47(VSS_3) U3.5(GND) U4.2 U5.1 U6.9(GND) U7.5(GND) U8.1(A0) U8.2(A1) U8.3(A2) U8.4(GND) U8.7(WP) U9.1(N.C.(GND)) U9.8(VSS) U9.12(BS2) U9.13(CS#) U9.16(R/W#) U9.17(E/RD#) U9.21(D3) U9.22(D4) U9.23(D5) U9.24(D6) U9.25(D7) U9.29(VLSS) U9.30(N.C.(GND)) U10.1(GND) U11.1(GND) U12.1(A1) U12.7(GND) U13.4(GND) U14.2 USB1.A1B12(GND) USB1.B1A12(GND) X1.2(GND) X1.4(GND)
VCC3V3: BUZZER1.1(+) C5.1 C6.2 C7.2 C11.2 C12.2 C26.2 C27.1 C33.2 C34.1 C35.2 CN1.1 CN1.2 H3.1 H6.1 H7.1 H8.3 H8.4 LED3.1(C) LED4.1(C) R4.1 R6.1 R7.2 R9.2 R10.2 R11.2 R16.2 R18.1 R19.3 R22.2 R32.2 R33.2 R34.2 R35.2 R36.2 R37.2 SW5.1(A1) U2.9(VDDA) U2.24(VDD_1) U2.36(VDD_2) U2.48(VDD_3) U3.8(VCC) U6.8(VCC) U7.2(VDD) U9.6(VBAT) U9.9(VDD) U9.11(BS1) U11.4(VOUT) U12.2(A0) U12.6(VS+) U13.3(WP#(IO2)) U13.7(HOLD# or RESET#(IO3)) U13.8(VCC)
VCC5V: C1.1 C2.1 C16.1 C23.1 C24.2 C25.2 D2.1(K) H1.6 H2.6 H8.5 H8.6 LED2.2(A) Q3.3(C) R15.2 R20.2 RELAY1.4 U1.3(VCC) U10.16(VCC) U11.3(VIN) U12.9(VIN-)
VCCBUS: C21.1 C22.1 D1.5 SW3.3 SW3.6 USB1.A4B9(VBUS) USB1.B4A9(VBUS)
VIN+: R15.1 SW3.2 U12.8(VBUS) U12.10(VIN+)
ADC_VR: R19.2 U2.11(PA1)
BEEP: R21.2 U2.2(PC13-TAMPER-RTC)
BOOT: H2.1 K1_ISP.1 R6.2 U6.12(GPIO0)
BOOT0: R25.2 SW5.2 U2.44(BOOT0)
CANRX: U1.4(RXD) U2.32(PA11)
CANTX: U1.1(TXD) U2.33(PA12)
CS1: H8.12 U2.10(PA0-WKUP)
D+: D1.3 D1.4 USB1.A7(Dn1) USB1.B7(Dn2)
D-: D1.1 D1.6 USB1.A6(Dp1) USB1.B6(Dp2)
FLASH_CS: H8.21 U2.14(PA4) U13.1(CS#)
IN8: H8.7 U2.18(PB0)
JNTRST: CN1.3 U2.40(PB4)
JTCK: CN1.9 R23.2 U2.37(PA14)
JTDI: CN1.5 U2.38(PA15)
JTDO: CN1.13 U2.39(PB3)
JTMS: CN1.7 R22.1 U2.34(PA13)
LED1: H8.20 R30.2 U2.46(PB9)
LED2: H8.22 R31.2 U2.45(PB8)
MISO1: H8.16 U2.16(PA6) U13.2(DO(IO1))
MOSI1: H8.18 U2.17(PA7) U13.5(DI(IO0))
NRST: C32.1 K5.1 R18.2
NRTS: CN1.15 U2.7(NRST) U6.1(RST)
OSC32_IN: C30.1 R17.2 U2.3(PC14-OSC32IN) X2.2(OSC2)
OSC32_OUT: C31.1 R17.1 U2.4(PC15-OSC32OUT) X2.1(OSC1)
OSC_IN: C29.1 U2.5(PD0-OSCIN) X3.1
OSC_OUT: C28.1 U2.6(PD1-OSCOUT) X3.2(GND)
RELAY: R29.2 U2.19(PB1)
RS483WR: U2.20(PB2)
RS485WR: R24.2 U3.2(RE#) U3.3(DE)
RXD1: H7.4 U2.31(PA10) U10.2(TXD)
RXD2: H6.4 U2.13(PA3) U3.1(RO)
RXD3: SW1.5 U2.22(PB11)
RXD3_4G: H1.4 H3.4 SW1.6
RXD3_WIFI: SW1.4 U6.16(TXD0)
SCL1: H8.10 R9.1 U2.42(PB6) U7.3(SCL) U8.6(SCL) U9.18(D0) U12.5(SCL)
SCLK1: H8.14 U2.15(PA5) U13.6(CLK)
SDA1: H8.8 R10.1 U2.43(PB7) U7.4(SDA) U8.5(SDA) U9.19(D1) U9.20(D2) U12.4(SDA)
SE_OK: H8.13
SW_DOWN: H8.15 K6.1 R33.1 U2.27(PB14)
SW_ESC: H8.11 K7.2 R36.1 U2.29(PA8)
SW_LEFT: H8.9 K3.1 R32.1 U2.41(PB5)
SW_OK: K8.1 R37.1 U2.25(PB12)
SW_RIGHT: H8.19 K4.2 R34.1 U2.28(PB15)
SW_UP: H8.17 K2.2 R35.1 U2.26(PB13)
TXD1: H7.3 U2.30(PA9) U10.3(RXD)
TXD2: H6.3 U2.12(PA2) U3.4(DI)
TXD3: SW1.2 U2.21(PB10)
TXD3_4G: H1.3 H3.3 SW1.3
TXD3_WIFI: SW1.1 U6.15(RXD0)
$1N557: H1.2 R20.1
$1N596: C3.1 H4.3 R2.2 U1.7(CANH)
$1N597: C4.2 H4.4 R2.1 U1.6(CANL)
$1N1084: U2.1(VBAT) U14.1
$1N1746: H5.4 R4.2 R5.1 U3.6(A) U5.2
$1N1751: H5.3 R3.1 R5.2 U3.7(B) U4.1
$1N2940: R7.1 U6.3(EN)
$1N2950: R8.2 U6.10(GPIO15)
$1N3707: C8.2 U8.8(VCC)
$1N5267: C9.2 U9.2(C2P)
$1N5272: C9.1 U9.3(C2N)
$1N5278: C10.2 U9.4(C1P)
$1N5284: C10.1 U9.5(C1N)
$1N5837: C15.2 U9.28(VCC)
$1N5842: C14.2 U9.27(VCOMH)
$1N5883: R13.2 U9.26(IREF)
$1N6063: R12.1 U9.15(D/C#)
$1N6069: C11.1 C12.1 U9.10(BS0)
$1N6084: C13.2 R11.1 U9.14(RES#)
$1N6699: C17.1 U10.4(V3)
$1N6703: C19.1 U10.8(XO) X1.3
$1N6777: C18.1 U10.7(XI)
$1N7168: C20.1 R14.2 USB1.13(EH) USB1.14(EH)
$1N8092: SW3.1 SW3.4
$1N8727: LED1.2(A) R16.1
$1N10027: BUZZER1.2 Q1.3(C)
$1N10142: Q1.1(B) R21.1
$1N11435: J1.1 RELAY1.3
$1N11440: J1.2 RELAY1.5
$1N11448: J1.3 RELAY1.2
$1N11611: D2.2(A) Q2.3(C) R26.1 RELAY1.1
$1N11703: Q2.2(E) R27.1
$1N11708: Q2.1(B) R27.2 R28.1
$1N11769: Q3.2(E) R28.2
$1N11813: LED2.1(C) R26.2
$1N11857: Q3.1(B) R29.1
$1N13620: LED3.2(A) R30.1
$1N13629: LED4.2(A) R31.1

Not connected (* = marked no-connect by the designer): CN1 11 17 19; H1 1; H2 2 3 4; H4 1; H5 1; SW3 5; U1 5(SPLIT); U6 2(ADC) 4(GPIO16) 5(GPIO14) 6(GPIO12) 7(GPIO13) 11(GPIO2) 13(GPIO4) 14(GPIO5) 17(CS0) 18(MISO) 19(GPIO9) 20(GPIO10) 21(MOSI) 22(SCLK); U7 1(NC) 6(NC); U9 7(N.C.); U10 5(UD+) 6(UD-) 9(CTS#) 10(DSR#) 11(RI#) 12(DCD#) 13(DTR#) 14(RTS#) 15(R232); U11 2(VOUT); U12 3(Alert); USB1 A5(CC1) A8(SBU1) B5(CC2) B8(SBU2); X1 1

## Notes on the sheet
- CAN总线
- 485总线
- 4G CAT1
- 继电器
- 扩展IO
- 电流传感器
- LED
- ESP8266 串口WIFI
- 主控
- SPI Flash
- 按键
- 温湿度传感器
- 系统电源
- EEPROM
- 系统时钟
- JTAG接口
- 复位
- 0-0 正常运行模式
  1-0 通过串口下载
- OLED
- BOOT选择
- USB转串口
- 电位器
- 蜂鸣器
